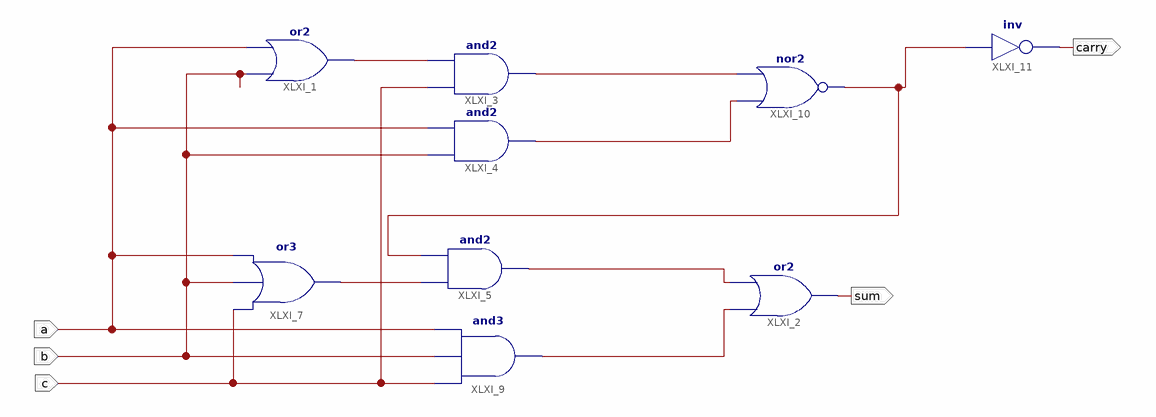
[diagram p0: schematic sheet 1]
// Xilinx ISE schematic fulladder.sch (spartan6) as structural Verilog: 9 symbols, 5 ports
module fulladder (
  input  c,
  input  b,
  input  a,
  output sum,
  output carry
);

  wire XLXN_1, XLXN_2, XLXN_3, XLXN_4, XLXN_7, XLXN_8, XLXN_9;

  or XLXI_1 (XLXN_1, b, a);
  or XLXI_2 (sum, XLXN_7, XLXN_8);
  and XLXI_3 (XLXN_2, c, XLXN_1);
  and XLXI_4 (XLXN_3, b, a);
  and XLXI_5 (XLXN_8, XLXN_4, XLXN_9);
  or XLXI_7 (XLXN_4, c, b, a);
  and XLXI_9 (XLXN_7, c, b, a);
  nor XLXI_10 (XLXN_9, XLXN_3, XLXN_2);
  not XLXI_11 (carry, XLXN_9);
endmodule
